# Altium schematic sheet Extension.SchDoc
size A3; PageSetup: Record=PageOptions|CenterHorizontal=True|CenterVertical=True|PrintScale=0.73|XCorrection=1.00|YCorrection=1.00|PrintKind=0|BorderSize=5000000|LeftOffset=0|BottomOffset=0|Orientation=2|PaperLength=1000|PaperWidth=1000|Scale=100|PaperSource=7|PrintQuality=-4|MediaType=1|DitherType=10|PaperKind=A4|PrintScaleMode=1; Date: 27.05.2014; DrawnBy: luths8; Organization: BFH; Address1: Bern University of Applied Sciences; Address2: Engineering and Information Technology; Address3: Jlcoweg 1; Address4: CH-3400 Burgdorf; DocumentNumber: 14; Revision: 1.1; SheetNumber: 14; SheetTotal: 16; CurrentDate: 27.05.2014
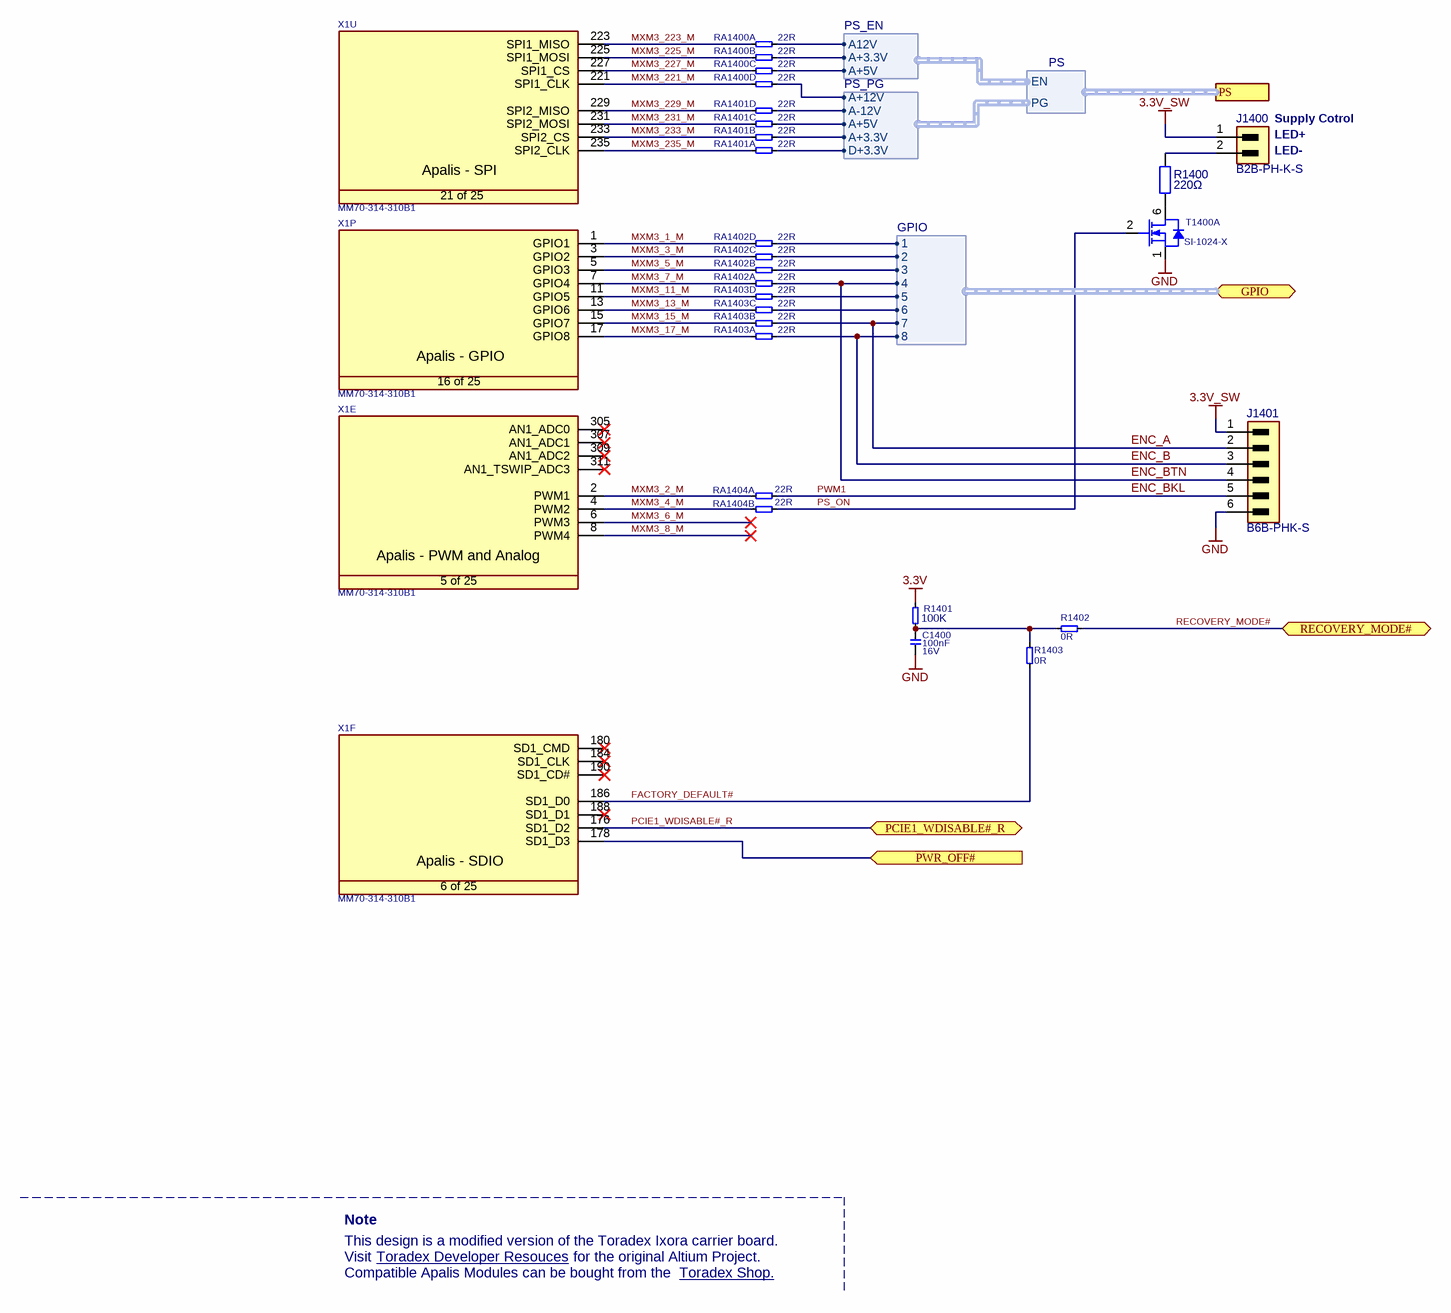
[diagram p0: Extension.SchDoc]

## Parts
C1400  Rating: 16V  [SMD0603CAP]  (hidden comment: 100nF)
J1400  B2B-PH-K-S  [B2B-PH-K-S]
J1401  B6B-PHK-S  [B6B-PH-K-S]
R1400  220Ω  [SMD0603RES]
R1401  100K  [SMD0603RES]
R1402  0R  [SMD0603RES]
R1403  0R  [SMD0603RES]
RA1400  22R  [T_Resistor_Array_X4]  (parts A,B,C,D of 4)
RA1401  22R  [T_Resistor_Array_X4]  (parts A,B,C,D of 4)
RA1402  22R  [T_Resistor_Array_X4]  (parts A,B,C,D of 4)
RA1403  22R  [T_Resistor_Array_X4]  (parts A,B,C,D of 4)
RA1404  22R  [T_Resistor_Array_X4]  (parts A,B of 4)
T1400  Manufacturer Part No.: SI-1024-X  [SOTFL50P160X60-6N]  (hidden comment: T-Vishay-SI-1024X-N)  (part A of 2)
X1  Manufacturer Part No.: MM70-314-310B1  [T_JAE_MM70-314-310B1]  (hidden comment: CON-JAE-MM70-314-310B1-314-0.5mm)  (parts E,F,P,U of 25)

## Ports
GPIO (bidir, harness GPIO, see 11, 12, 4), PCIE1_WDISABLE#_R (bidir, see 18), PS (harness PS), PWR_OFF# (in, see 18), RECOVERY_MODE# (bidir, see 11)

## Harnesses
PS: EN, PG
GPIO: 1, 2, 3, 4, 5, 6, 7, 8
PS_EN: A12V, A+3.3V, A+5V
PS_PG: A+12V, A-12V, A+3.3V, A+5V, D+3.3V

## Nets
3.3V: R1401.1
3.3V_SW: J1400.1 J1401.1
GND: C1400.1 J1401.6 T1400.1(S)
ENC_A: J1401.2 RA1403.6 ; port GPIO.7
ENC_B: J1401.3 RA1403.5 ; port GPIO.8
ENC_BKL: J1401.5 RA1404.1  [also labelled PWM1]
ENC_BTN: J1401.4 RA1402.5 ; port GPIO.4
FACTORY_DEFAULT#: R1403.1 X1.186(SD1_D0)
MXM3_1_M: RA1402.4 X1.1(GPIO1)
MXM3_2_M: RA1404.5 X1.2(PWM1)
MXM3_3_M: RA1402.3 X1.3(GPIO2)
MXM3_4_M: RA1404.6 X1.4(PWM2)
MXM3_5_M: RA1402.2 X1.5(GPIO3)
MXM3_6_M: X1.6(PWM3)
MXM3_7_M: RA1402.1 X1.7(GPIO4)
MXM3_8_M: X1.8(PWM4)
MXM3_11_M: RA1403.4 X1.11(GPIO5)
MXM3_13_M: RA1403.3 X1.13(GPIO6)
MXM3_15_M: RA1403.2 X1.15(GPIO7)
MXM3_17_M: RA1403.1 X1.17(GPIO8)
MXM3_221_M: RA1400.4 X1.221(SPI1_CLK)
MXM3_223_M: RA1400.1 X1.223(SPI1_MISO)
MXM3_225_M: RA1400.2 X1.225(SPI1_MOSI)
MXM3_227_M: RA1400.3 X1.227(SPI1_CS)
MXM3_229_M: RA1401.4 X1.229(SPI2_MISO)
MXM3_231_M: RA1401.3 X1.231(SPI2_MOSI)
MXM3_233_M: RA1401.2 X1.233(SPI2_CS)
MXM3_235_M: RA1401.1 X1.235(SPI2_CLK)
PCIE1_WDISABLE#_R: X1.176(SD1_D2) ; port PCIE1_WDISABLE#_R
PS_ON: RA1404.2 T1400.2(G)
PWR_OFF#: X1.178(SD1_D3) ; port PWR_OFF#
RECOVERY_MODE#: R1402.2 ; port RECOVERY_MODE#
NetC1400_2: C1400.2 R1401.2 R1402.1 R1403.2
NetJ1400_2: J1400.2 R1400.2
NetR1400_1: R1400.1 T1400.6(D)
NetRA1400_5: RA1400.5 ; harness PS_EN.A12V
NetRA1400_6: RA1400.6 ; harness PS_EN.A+3.3V
NetRA1400_7: RA1400.7 ; harness PS_EN.A+5V
NetRA1400_8: RA1400.8 ; harness PS_PG.A+12V
NetRA1401_5: RA1401.5 ; harness PS_PG.D+3.3V
NetRA1401_6: RA1401.6 ; harness PS_PG.A+3.3V
NetRA1401_7: RA1401.7 ; harness PS_PG.A+5V
NetRA1401_8: RA1401.8 ; harness PS_PG.A-12V
NetRA1402_6: RA1402.6 ; port GPIO.3
NetRA1402_7: RA1402.7 ; port GPIO.2
NetRA1402_8: RA1402.8 ; port GPIO.1
NetRA1403_7: RA1403.7 ; port GPIO.6
NetRA1403_8: RA1403.8 ; port GPIO.5

Not connected (* = marked no-connect by the designer): X1 180(SD1_CMD)* 184(SD1_CLK)* 188(SD1_D1)* 190(SD1_CD#)* 305(AN1_ADC0)* 307(AN1_ADC1)* 309(AN1_ADC2)* 311(AN1_TSWIP_ADC3)*

## Notes on the sheet
- (near J1400) Supply Cotrol
- (near J1400) LED+
- (near J1400) LED-
- Note
- This design is a modified version of the Toradex Ixora carrier board.
- Visit
- Compatible Apalis Modules can be bought from the
- Toradex Developer Resouces <https://developer.toradex.com/products/ixora-carrier-board>
- for the original Altium Project.
- Toradex Shop. <https://www.toradex.com/order-now/apalis-arm-family>
- Project:
- Size:
- Sheet:
- Title:
- A3
- of
- Drawn by:
- Revision:
- Date:
- Variant:
- b
- File:
- (in symbol CON-JAE-MM70-314-310B1-314-0.5mm, part E) Apalis - PWM and Analog; 5 of 25
- (in symbol CON-JAE-MM70-314-310B1-314-0.5mm, part F) Apalis - SDIO; 6 of 25
- (in symbol CON-JAE-MM70-314-310B1-314-0.5mm, part P) Apalis - GPIO; 16 of 25
- (in symbol CON-JAE-MM70-314-310B1-314-0.5mm, part U) Apalis - SPI; 21 of 25

## Library data of the parts
C1400 = C-X7R-100nF-16V-10%-0402: Capacitor Ceramic X7R 100nF 16V 10% 0603; Tolerance: 10%; Type: X7R; Value: 100nF
J1400 = Connector 2x1P: Manufacturer Part No.: B2B-PH-K-S; System: Connector
J1401 = Connector 6x1P: Manufacturer Part No.: B6B-PHK-S; System: Connector
R1400 = Resistor
R1401 = R-100KR-63mW-5%-0402: Resistor 100 Kohm 63mW 5% 0603; Value: 100KR; Rating: 63mW; Tolerance: 5%
R1402 R1403 = R-0R-63mW-1%-0603: Resistor 0 ohm 63mW 1% 0603; Rating: 63mW; Tolerance: 1%; Value: 0R
RA1400-RA1404 = RA-22R-63mW-5%-1206-div: Resistor Array 22 R 63mW 5% 1206; Tolerance: 5%; Power Dissipation: 63mW; Value: 22R
T1400 = T-Vishay-SI-1024X-N: Dual N-Channel 20V (D-S)  MOSFET; Manufacturer Name: Vishay
X1 = CON-JAE-MM70-314-310B1-314-0.5mm: MXM3 Connector; Manufacturer Name: JAE; No. of ways: 314